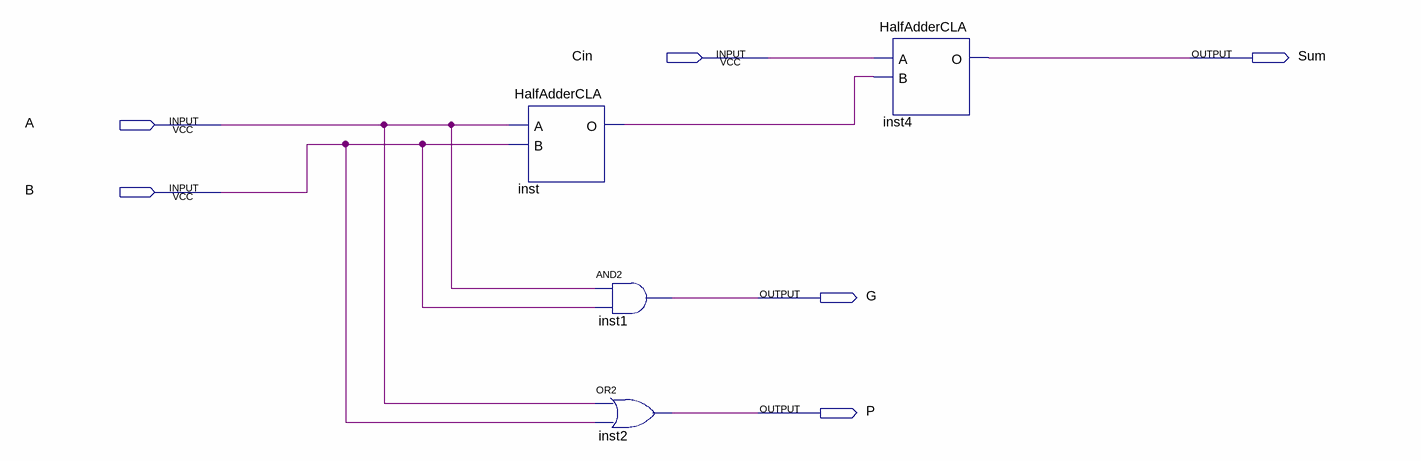
[diagram p0: schematic sheet]
// Quartus schematic FullAdderCLA.bdf as structural Verilog: 4 symbols, 6 pins
module FullAdderCLA (
  input  Cin,
  input  A,
  input  B,
  output Sum,
  output G,
  output P
);

  wire inst_o;

  HalfAdderCLA inst (.A(A), .B(B), .O(inst_o));
  and inst1 (G, A, B);
  or inst2 (P, A, B);
  HalfAdderCLA inst4 (.A(Cin), .B(inst_o), .O(Sum));
endmodule
